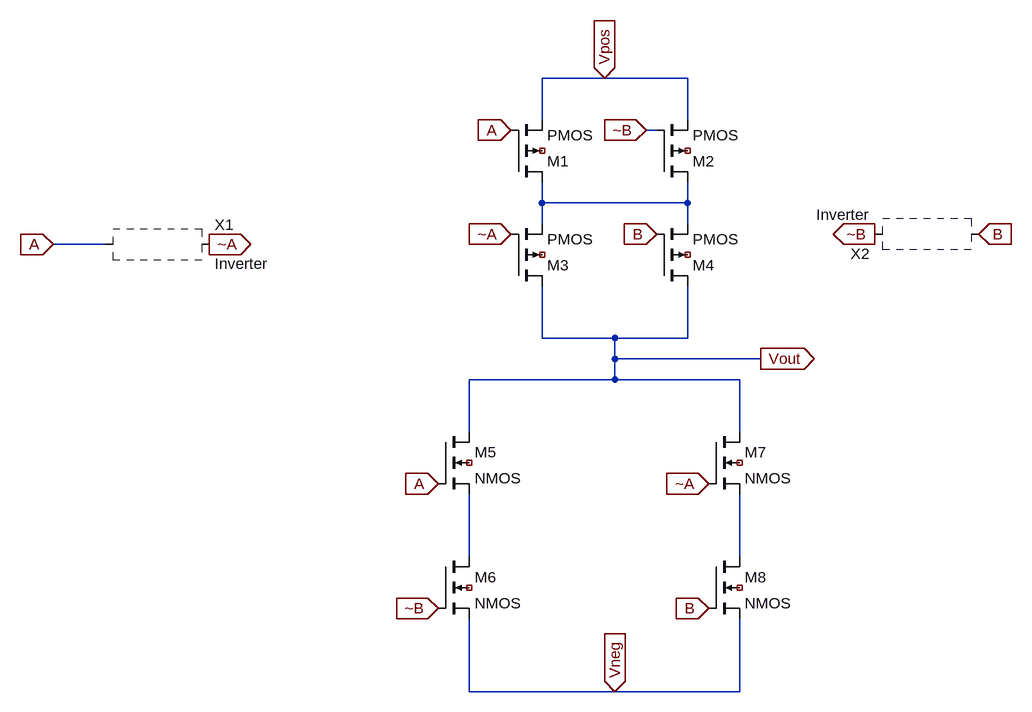
[diagram p0: schematic XOR.asc]
XOR.asc, the LTspice schematic file:
Version 4
SHEET 1 884 1004
WIRE 240 0 144 0
WIRE 368 0 240 0
WIRE 144 64 144 0
WIRE 368 64 368 0
WIRE 320 80 304 80
WIRE 144 192 144 160
WIRE 368 192 368 160
WIRE 368 192 144 192
WIRE 144 224 144 192
WIRE 368 224 368 192
WIRE -528 256 -608 256
WIRE 144 400 144 320
WIRE 256 400 144 400
WIRE 368 400 368 320
WIRE 368 400 256 400
WIRE 256 432 256 400
WIRE 480 432 256 432
WIRE 256 464 256 432
WIRE 256 464 32 464
WIRE 448 464 256 464
WIRE 32 544 32 464
WIRE 448 544 448 464
WIRE 32 736 32 640
WIRE 448 736 448 640
WIRE 32 944 32 832
WIRE 256 944 32 944
WIRE 448 944 448 832
WIRE 448 944 256 944
FLAG -608 256 A
IOPIN -608 256 In
FLAG -368 256 ~A
IOPIN -368 256 Out
FLAG 96 80 A
IOPIN 96 80 In
FLAG 96 240 ~A
IOPIN 96 240 In
FLAG 304 80 ~B
IOPIN 304 80 In
FLAG 320 240 B
IOPIN 320 240 In
FLAG 656 240 ~B
IOPIN 656 240 Out
FLAG 816 240 B
IOPIN 816 240 In
FLAG 480 432 Vout
IOPIN 480 432 Out
FLAG -16 624 A
IOPIN -16 624 In
FLAG 400 624 ~A
IOPIN 400 624 In
FLAG 400 816 B
IOPIN 400 816 In
FLAG -16 816 ~B
IOPIN -16 816 In
FLAG 240 0 Vpos
IOPIN 240 0 In
FLAG 256 944 Vneg
IOPIN 256 944 In
SYMBOL pmos4 96 160 M180
SYMATTR InstName M1
SYMBOL pmos4 320 160 M180
SYMATTR InstName M2
SYMBOL pmos4 96 320 M180
SYMATTR InstName M3
SYMBOL pmos4 320 320 M180
SYMATTR InstName M4
SYMBOL nmos4 -16 544 R0
SYMATTR InstName M5
SYMBOL nmos4 -16 736 R0
SYMATTR InstName M6
SYMBOL nmos4 400 544 R0
SYMATTR InstName M7
SYMBOL nmos4 400 736 R0
SYMATTR InstName M8
SYMBOL HW5\\Inverter 752 240 R180
SYMATTR InstName X2
SYMBOL HW5\\Inverter -464 256 R0
SYMATTR InstName X1

The netlist it stands for:
* XOR.asc
M1 N001 A Vpos NC_01 PMOS
M2 N001 ~B Vpos NC_02 PMOS
M3 Vout ~A N001 NC_03 PMOS
M4 Vout B N001 NC_04 PMOS
M5 Vout A N002 NC_05 NMOS
M6 N002 ~B Vneg NC_06 NMOS
M7 Vout ~A N003 NC_07 NMOS
M8 N003 B Vneg NC_08 NMOS
* X2: Inverter (symbol HW5\Inverter not available, pin order unknown); nets seen at it: B, ~B
* X1: Inverter (symbol HW5\Inverter not available, pin order unknown); nets seen at it: A, ~A
.model NMOS NMOS
.model PMOS PMOS
.lib standard.mos
.backanno
.end